# EAGLE schematic iForgeHat (EAGLE 8.1.0)

## Sheet 1 of 2
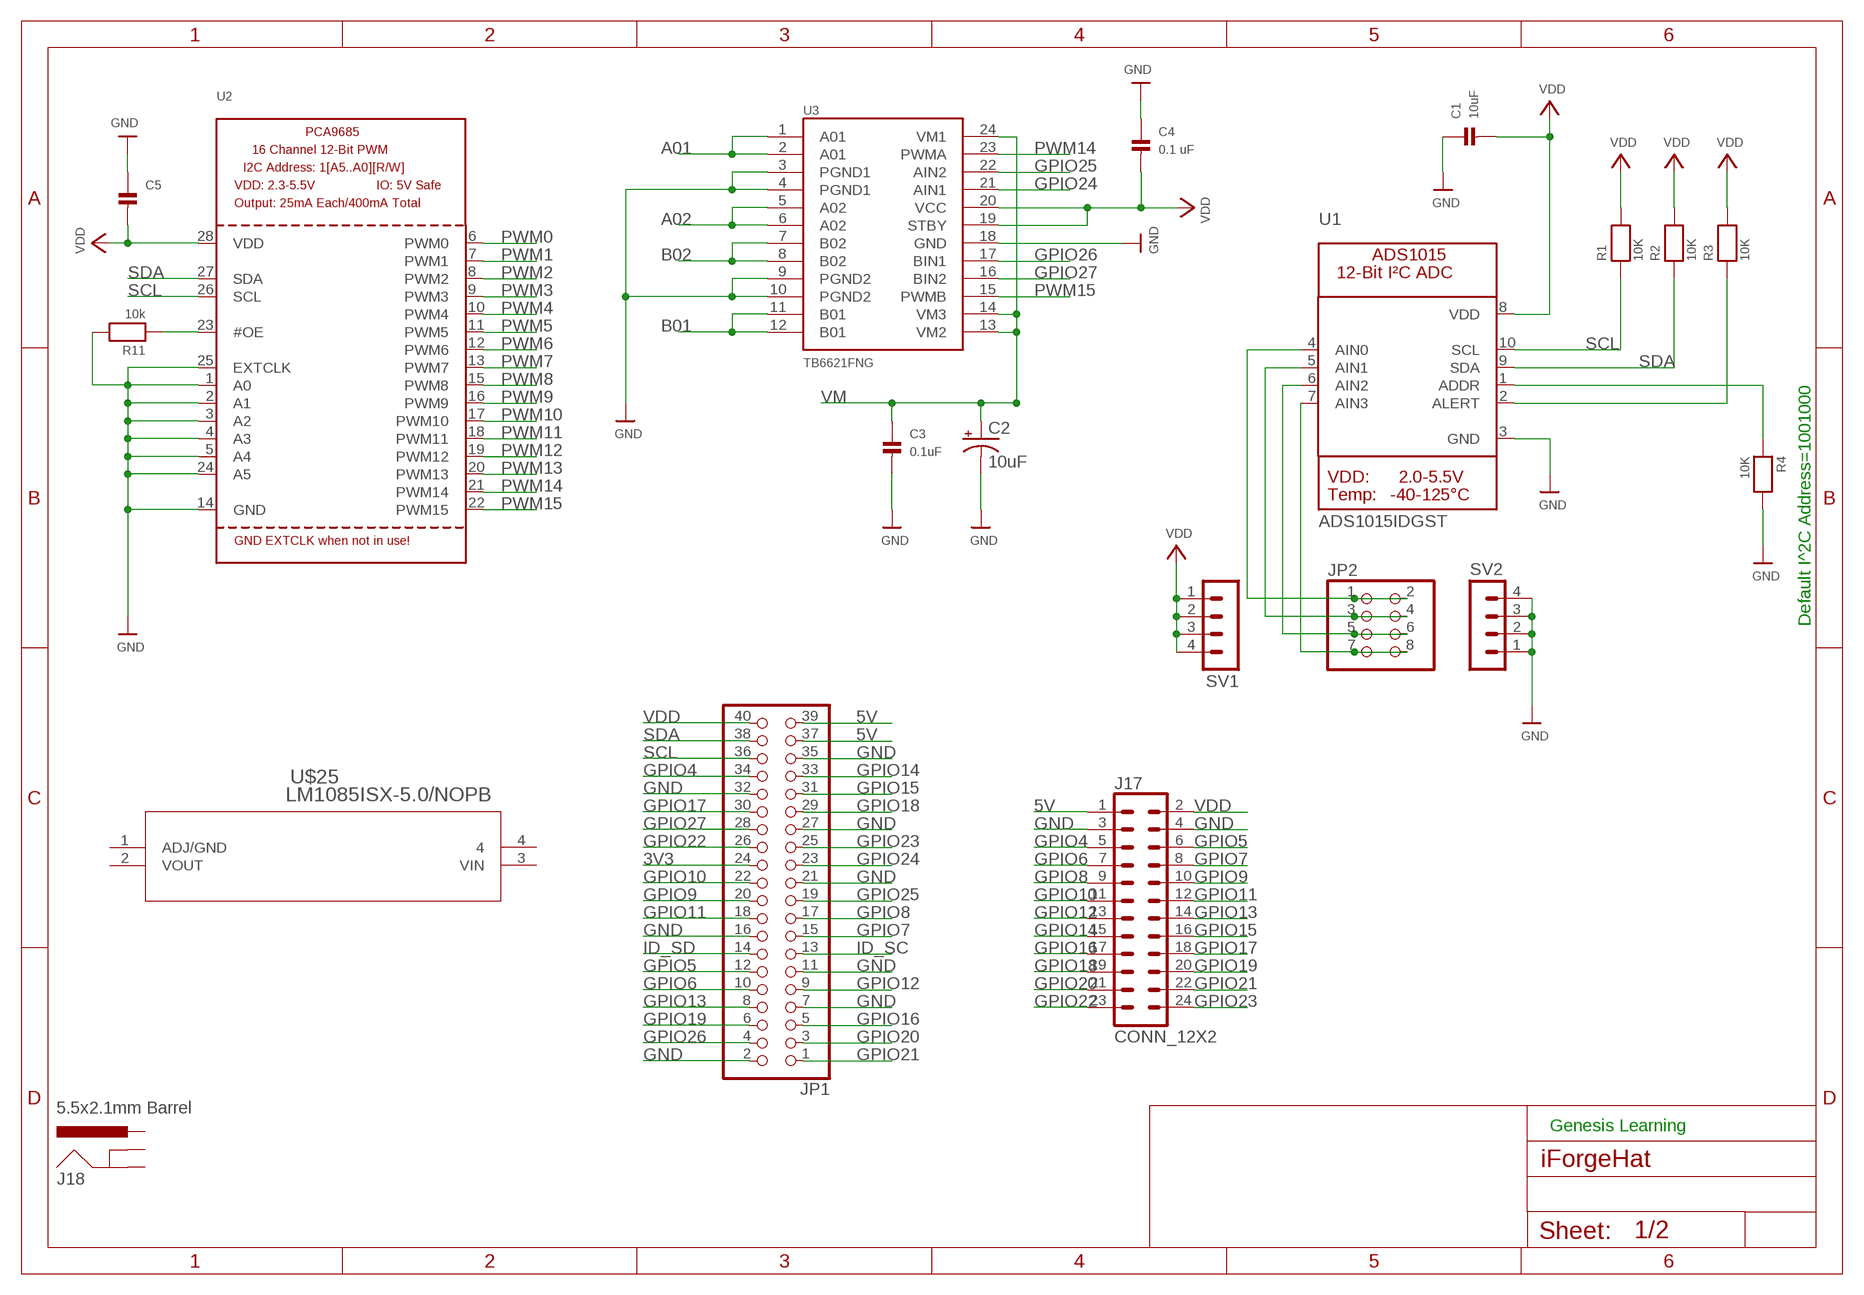
[diagram p0: schematic, sheet 1]

### Parts
C1  10uF  CAP_CERAMIC0402  [0402]
C2  10uF  SUPERCAP  [414-VA5R]
C3  0.1uF  CAP_CERAMIC0402  [0402]
C4  0.1 uF  CAP_CERAMIC0402  [0402]
C5  CAP_CERAMIC0402  [0402]
J17  CONN_12X2  [2X12]
J18  5.5x2.1mm Barrel  POWER_JACKSMD  [POWER_JACK_SMD]
JP1  PINHD-2X20  [2X20]
JP2  PINHD-2X4  [2X04]
R1  10K  RESISTOR0402  [0402]
R2  10K  RESISTOR0402  [0402]
R3  10K  RESISTOR0402  [0402]
R4  10K  RESISTOR0402  [0402]
R11  10k  RESISTOR0402  [0402]
SV1  MA04-1  [MA04-1]
SV2  MA04-1  [MA04-1]
U1  ADS1015IDGST  ADC_ADS1015  [MSOP10]
U2  PCA9685  [TSSOP28]
U3  TB6621FNG  [SSOP24]
U$25  LM1085ISX-5.0/NOPB  [TS3B]

### Nets
3V3: JP1.24
5V: J17.1 JP1.37 JP1.39
A01: U3.1(A01) U3.2(A01) ; also sheet 2
A02: U3.5(A02) U3.6(A02) ; also sheet 2
B01: U3.11(B01) U3.12(B01) ; also sheet 2
B02: U3.7(B02) U3.8(B02) ; also sheet 2
GND: C1.1 C2.- C3.2 C4.1 C5.1 J17.3 J17.4 JP1.2 JP1.7 JP1.11 JP1.16 JP1.21 JP1.27 JP1.32 JP1.35 R4.2 R11.2 SV2.1 SV2.2 SV2.3 SV2.4 U1.3(GND) U2.1(A0) U2.2(A1) U2.3(A2) U2.4(A3) U2.5(A4) U2.14(GND) U2.24(A5) U2.25(EXTCLK) U3.3(PGND1) U3.4(PGND1) U3.9(PGND2) U3.10(PGND2) U3.18(GND) ; also sheet 2
GPIO4: J17.5 JP1.34
GPIO5: J17.6 JP1.12
GPIO6: J17.7 JP1.10
GPIO7: J17.8 JP1.15
GPIO8: J17.9 JP1.17
GPIO9: J17.10 JP1.20
GPIO10: J17.11 JP1.22
GPIO11: J17.12 JP1.18
GPIO12: J17.13 JP1.9
GPIO13: J17.14 JP1.8
GPIO14: J17.15 JP1.33
GPIO15: J17.16 JP1.31
GPIO16: J17.17 JP1.5
GPIO17: J17.18 JP1.30
GPIO18: J17.19 JP1.29
GPIO19: J17.20 JP1.6
GPIO20: J17.21 JP1.3
GPIO21: J17.22 JP1.1
GPIO22: J17.23 JP1.26
GPIO23: J17.24 JP1.25
GPIO24: JP1.23 U3.21(AIN1)
GPIO25: JP1.19 U3.22(AIN2)
GPIO26: JP1.4 U3.17(BIN1)
GPIO27: JP1.28 U3.16(BIN2)
ID_SC: JP1.13
ID_SD: JP1.14
N$1: R11.1 U2.23(#OE)
N$3: R3.1 U1.2(ALERT)
N$4: R4.1 U1.1(ADDR)
N$7: JP2.1 JP2.2 U1.4(AIN0)
N$8: JP2.3 JP2.4 U1.5(AIN1)
N$9: JP2.5 JP2.6 U1.6(AIN2)
N$10: JP2.7 JP2.8 U1.7(AIN3)
PWM0: U2.6(PWM0) ; also sheet 2
PWM1: U2.7(PWM1) ; also sheet 2
PWM2: U2.8(PWM2) ; also sheet 2
PWM3: U2.9(PWM3) ; also sheet 2
PWM4: U2.10(PWM4) ; also sheet 2
PWM5: U2.11(PWM5) ; also sheet 2
PWM6: U2.12(PWM6) ; also sheet 2
PWM7: U2.13(PWM7) ; also sheet 2
PWM8: U2.15(PWM8) ; also sheet 2
PWM9: U2.16(PWM9) ; also sheet 2
PWM10: U2.17(PWM10) ; also sheet 2
PWM11: U2.18(PWM11) ; also sheet 2
PWM12: U2.19(PWM12) ; also sheet 2
PWM13: U2.20(PWM13) ; also sheet 2
PWM14: U2.21(PWM14) U3.23(PWMA)
PWM15: U2.22(PWM15) U3.15(PWMB)
SCL: JP1.36 R1.1 U1.10(SCL) U2.26(SCL)
SDA: JP1.38 R2.1 U1.9(SDA) U2.27(SDA)
VDD: C1.2 C4.2 C5.2 J17.2 JP1.40 R1.2 R2.2 R3.2 SV1.1 SV1.2 SV1.3 SV1.4 U1.8(VDD) U2.28(VDD) U3.19(STBY) U3.20(VCC) ; also sheet 2
VM: C2.+ C3.1 U3.13(VM2) U3.14(VM3) U3.24(VM1)
Unconnected: J18.GND(GNDBREAK) J18.P$4(GND) J18.VIN0(PWR) U$25.1(ADJ/GND) U$25.2(VOUT) U$25.3(VIN) U$25.4

### Notes on the sheet
- Default I^2C Address=1001000
- Genesis Learning

## Sheet 2 of 2
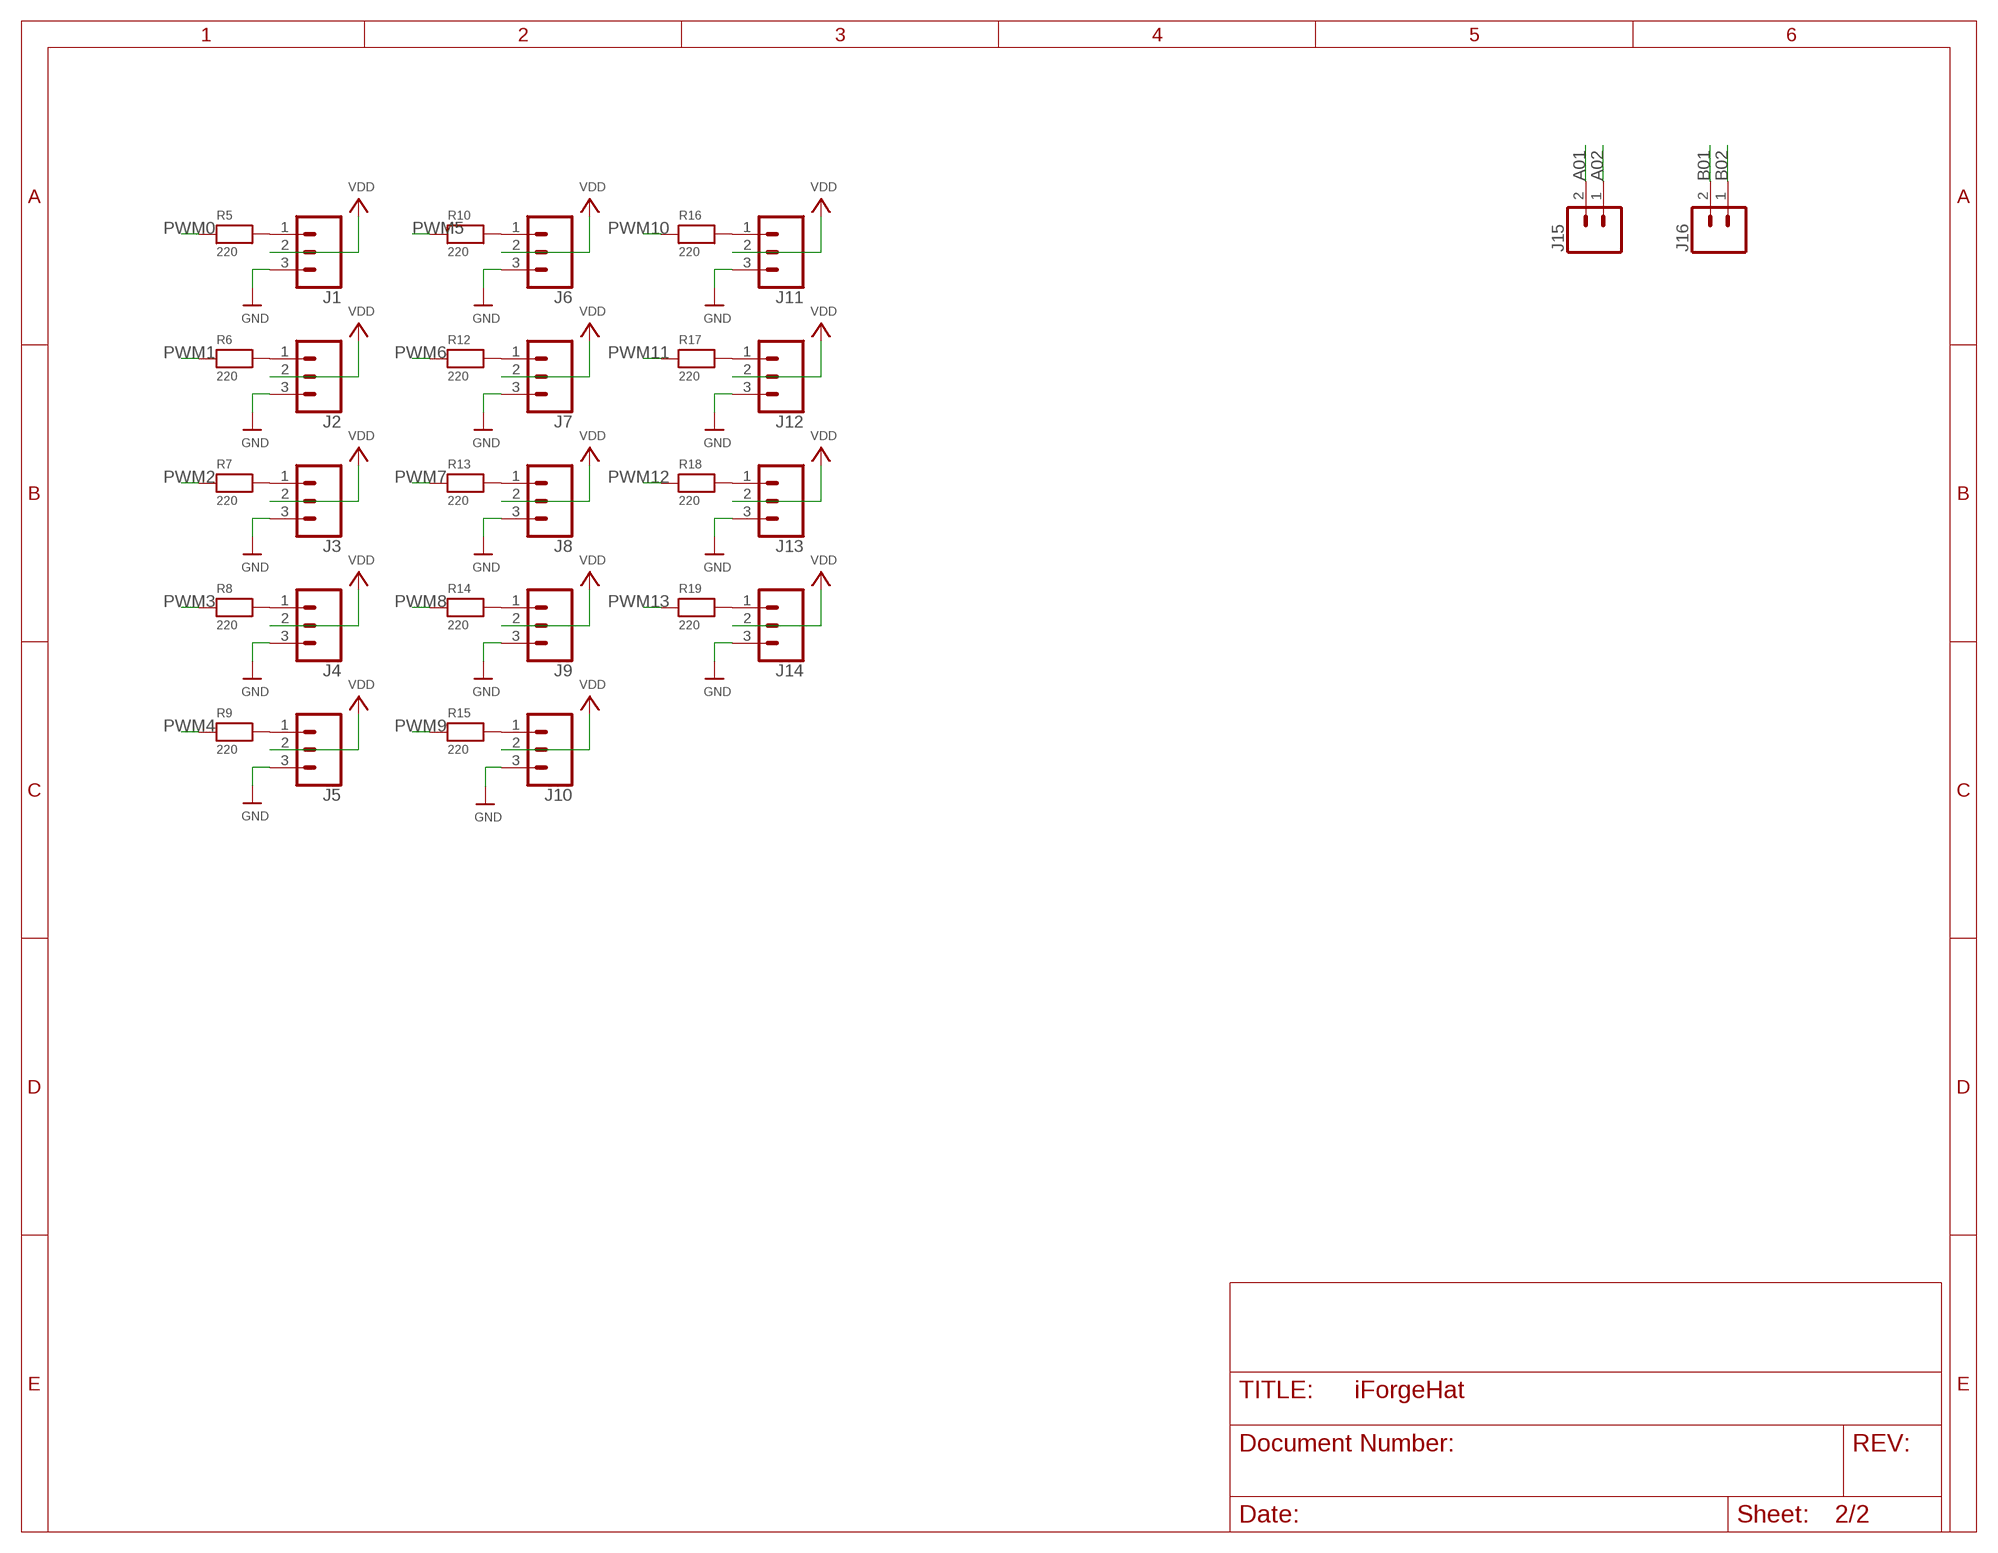
[diagram p1: schematic, sheet 2]

### Parts
J1  CONN_03  [1X03]
J2  CONN_03  [1X03]
J3  CONN_03  [1X03]
J4  CONN_03  [1X03]
J5  CONN_03  [1X03]
J6  CONN_03  [1X03]
J7  CONN_03  [1X03]
J8  CONN_03  [1X03]
J9  CONN_03  [1X03]
J10  CONN_03  [1X03]
J11  CONN_03  [1X03]
J12  CONN_03  [1X03]
J13  CONN_03  [1X03]
J14  CONN_03  [1X03]
J15  CONN_02SPRING-2.54-RA  [SPRINGTERMINAL-2.54MM-2]
J16  CONN_02SPRING-2.54-RA  [SPRINGTERMINAL-2.54MM-2]
R5  220  RESISTOR0402  [0402]
R6  220  RESISTOR0402  [0402]
R7  220  RESISTOR0402  [0402]
R8  220  RESISTOR0402  [0402]
R9  220  RESISTOR0402  [0402]
R10  220  RESISTOR0402  [0402]
R12  220  RESISTOR0402  [0402]
R13  220  RESISTOR0402  [0402]
R14  220  RESISTOR0402  [0402]
R15  220  RESISTOR0402  [0402]
R16  220  RESISTOR0402  [0402]
R17  220  RESISTOR0402  [0402]
R18  220  RESISTOR0402  [0402]
R19  220  RESISTOR0402  [0402]

### Nets
A01: J15.2 ; also sheet 1
A02: J15.1 ; also sheet 1
B01: J16.2 ; also sheet 1
B02: J16.1 ; also sheet 1
GND: J1.3 J2.3 J3.3 J4.3 J5.3 J6.3 J7.3 J8.3 J9.3 J10.3 J11.3 J12.3 J13.3 J14.3 ; also sheet 1
N$2: J14.1 R19.2
N$5: J11.1 R16.2
N$6: J12.1 R17.2
N$11: J6.1 R10.2
N$12: J7.1 R12.2
N$13: J9.1 R14.2
N$14: J5.1 R9.2
N$15: J4.1 R8.2
N$16: J3.1 R7.2
N$17: J2.1 R6.2
N$18: J1.1 R5.2
N$19: J13.1 R18.2
N$20: J8.1 R13.2
N$21: J10.1 R15.2
PWM0: R5.1 ; also sheet 1
PWM1: R6.1 ; also sheet 1
PWM2: R7.1 ; also sheet 1
PWM3: R8.1 ; also sheet 1
PWM4: R9.1 ; also sheet 1
PWM5: R10.1 ; also sheet 1
PWM6: R12.1 ; also sheet 1
PWM7: R13.1 ; also sheet 1
PWM8: R14.1 ; also sheet 1
PWM9: R15.1 ; also sheet 1
PWM10: R16.1 ; also sheet 1
PWM11: R17.1 ; also sheet 1
PWM12: R18.1 ; also sheet 1
PWM13: R19.1 ; also sheet 1
VDD: J1.2 J2.2 J3.2 J4.2 J5.2 J6.2 J7.2 J8.2 J9.2 J10.2 J11.2 J12.2 J13.2 J14.2 ; also sheet 1

## Library data of the parts
C1 C3-C5 = adc1015microbuilder:CAP_CERAMIC: Ceramic Capacitors 0402 - 0402 Surface Mount Capacitors 16pF 50V 5% [Digikey: 445-4899-2-ND] 18pF 50V 5% [Digikey: 490-1281-2-ND] 22pF 50V 5% [Digikey: 490-1283-2-ND] 68pF 50V 5% [Digikey: 490-1289-2-ND] 0.1uF 10V 10% [Digikey: 490-1318-2-ND] 1.0uF 6.3V 10% [Digikey: 490-1320-2-ND] 0603 - 0603 Surface Mount Capacitors 16 pF 50V 5% [Digikey: 445-5051-2-ND] 22 pF 50V [Digikey: PCC220ACVTR-ND] 33 pF 50V 5% [Digikey: 490-1415-1-ND] 56pF 50V 5% [Digikey: 490-1421-1-ND] 220pF 50V 5% [Digikey: 445-1285-1-ND] 680 pF 50V 2200 pF 50V 5% C0G [Digikey: 445-1297-1-ND] 5600 pF 100V 5% X7R [Digikey: 478-3711-1-ND] 0.1 µF 25V 10% [Digikey: PCC2277TR-ND] 0.22 µF 16V 10% X7R [Digikey: 445-1318-1-ND] 1.0 µF 25V 10% [Digikey: 445-5146-2-ND] 0603 - RF Specific 3pF 250V +/-0.1pF RF [Digikey: 712-1347-1-ND] 18 pF 250V 5% [Digikey: 478-3505-1-ND or 712-1322-1-ND] 56 pF 250V 5% C0G RF [Digikey: 490-4867-1-ND] 68 pF 250V RF [Digikey: 490-4868-1-ND] 0805 - 0805 Surface Mount Capacitors 220 pF 250V 2% RF Ceramic Capacitor [Digikey: 712-1398-1-ND] 1000 pF 50V 2% NP0 Ceramic Capacitor [Digikey: 478-3760-1-ND] 0.1 µF 25V 10% Ceramic Capacitor [Digikey: PCC1828TR-ND] 1.0 µF 16V 10% Ceramic Capacitor[Digikey: 490-1691-2-ND] 10.0 µF 10V 10% Ceramic Capacitor[Digikey: 709-1228-1-ND] 10.0 uF 16V 10% Ceramic Capacitor [Digikey: 478-5165-2-ND] 47 uF 6.3V 20% Ceramic Capacitor [Digikey: 587-1779-1-ND or 399-5506-1-ND] 1206 - 1206 Surface Mount Capacitors 47uF 10V 20% Ceramic Capacitor [Digikey: 490-5528-1-ND or 399-5508-1-ND or 445-6010-1-ND] 100uF 6.3V -20%, +80% Y5V Ceramic Capacitor (Digikey: 490-4512-1-ND, Mouser: 81-GRM31CF50J107ZE1L)
C2 = adafruit:SUPERCAP
J1-J14 = SparkFun-Connectors:CONN_03: Multi connection point. Often used as Generic Header-pin footprint for 0.1 inch spaced/style header connections On any of the 0.1 inch spaced packages, you can populate with these: Break Away Headers - Straight <https://www.sparkfun.com/products/116> (PRT-00116) Break Away Male Headers - Right Angle <https://www.sparkfun.com/products/553> (PRT-00553) Female Headers <https://www.sparkfun.com/products/115> (PRT-00115) Break Away Headers - Machine Pin <https://www.sparkfun.com/products/117> (PRT-00117) Break Away Female Headers - Swiss Machine Pin <https://www.sparkfun.com/products/743> (PRT-00743) Stackable Header - 3 Pin (Female, 0.1") <https://www.sparkfun.com/products/13875> (PRT-13875) For SCREWTERMINALS and SPRING TERMINALS visit here: Screw Terimnals on SparkFun.com <https://www.sparkfun.com/search/results?term=Screw+Terminals> (5mm/3.5mm/2.54mm spacing) This device is also useful as a general connection point to wire up your design to another part of your project. Our various solder wires solder well into these plated through hole pads. Hook-Up Wire - Assortment (Stranded, 22 AWG) <https://www.sparkfun.com/products/11375> (PRT-11375) Hook-Up Wire - Assortment (Solid Core, 22 AWG) <https://www.sparkfun.com/products/11367> (PRT-11367) View the entire wire category on our website here <https://www.sparkfun.com/categories/141> Special notes: Molex polarized connector foot print use with SKU : PRT-08232 with associated crimp pins and housings.
J15 J16 = SparkFun-Connectors:CONN_02: Multi connection point. Often used as Generic Header-pin footprint for 0.1 inch spaced/style header connections On any of the 0.1 inch spaced packages, you can populate with these: Break Away Headers - Straight <https://www.sparkfun.com/products/116> (PRT-00116) Break Away Male Headers - Right Angle <https://www.sparkfun.com/products/553> (PRT-00553) Female Headers <https://www.sparkfun.com/products/115> (PRT-00115) Break Away Headers - Machine Pin <https://www.sparkfun.com/products/117> (PRT-00117) Break Away Female Headers - Swiss Machine Pin <https://www.sparkfun.com/products/743> (PRT-00743) For SCREWTERMINALS and SPRING TERMINALS visit here: Screw Terimnals on SparkFun.com <https://www.sparkfun.com/search/results?term=Screw+Terminals> (5mm/3.5mm/2.54mm spacing) This device is also useful as a general connection point to wire up your design to another part of your project. Our various solder wires solder well into these plated through hole pads. Hook-Up Wire - Assortment (Stranded, 22 AWG) <https://www.sparkfun.com/products/11375> (PRT-11375) Hook-Up Wire - Assortment (Solid Core, 22 AWG) <https://www.sparkfun.com/products/11367> (PRT-11367) View the entire wire category on our website here <https://www.sparkfun.com/categories/141> Special notes: Molex polarized connector foot print use with: PRT-08233 with associated crimp pins and housings. 2.54_SCREWTERM for use with PRT-10571. 3.5mm Screw Terminal footprints for PRT-08084 5mm Screw Terminal footprints for use with PRT-08432
J17 = SparkFun-Connectors:CONN_12X2: Multi connection point. Often used as Generic Header-pin footprint for 0.1 inch spaced/style header connections On any of the 0.1 inch spaced packages, you can populate with these: Break Away Headers - Straight <https://www.sparkfun.com/products/116> (PRT-00116) Break Away Male Headers - Right Angle <https://www.sparkfun.com/products/553> (PRT-00553) Female Headers <https://www.sparkfun.com/products/115> (PRT-00115) Break Away Headers - Machine Pin <https://www.sparkfun.com/products/117> (PRT-00117) Break Away Female Headers - Swiss Machine Pin <https://www.sparkfun.com/products/743> (PRT-00743)
J18 = SparkFun-Connectors:POWER_JACK: Power Jack Connector This is the standard 5.5mm barrel jack for power. The PTH is the most common, proven, reliable, footprint. The Slot footprint only works if the mill layer is transmitted to the PCB fab house so be warned. Here are the connectors we sell at SparkFun: DC Barrel Power Jack/Connector <https://www.sparkfun.com/products/119> (PRT-00119) DC Barrel Power Jack/Connector (SMD) <https://www.sparkfun.com/products/12748> (PRT-12748) DC Barrel Jack Adapter - Breadboard Compatible <https://www.sparkfun.com/products/10811> (PRT-10811) It is used on this SparkFun product (and many, many others): SparkFun RedBoard - Programmed with Arduino <https://www.sparkfun.com/products/12757> (DEV-12757) Also, if you need a mating power supply or connector, please check these out: Wall Adapter Power Supply - 9VDC 650mA <https://www.sparkfun.com/products/298> (TOL-00298) DC Barrel Jack Adapter - Male <https://www.sparkfun.com/products/10287> (PRT-10287); PROD_ID: CONN-08106; SF_ID: PRT-12748
JP1 = adafruit:PINHD-2X20: PIN HEADER
JP2 = adafruit:PINHD-2X4: PIN HEADER
R1-R19 = adc1015microbuilder:RESISTOR: Resistors 0402 - 0402 Surface Mount Package 22 Ohm 1% 1/16W [Digikey: 311-22.0LRTR-ND] 33 Ohm 5% 1/16W 1.0K 5% 1/16W 1.5K 5% 1/16W 2.0K 1% 1/16W 10.0K 1% 1/16W [Digikey: 311-10.0KLRTR-ND] 10.0K 5% 1/16W [Digikey: RMCF0402JT10K0TR-ND] 12.1K 1% 1/16W [Digikey: 311-22.0LRTR-ND] 100.0K 5% 1/16W 0603 - 0603 Surface Mount Package 0 Ohm 1/10 Watt 1% Resistor 15 Ohm 1/10 Watt 1% Resistor 33 Ohm 1/10 Watt 1% Resistor 49.9 Ohm 1/10 Watt 1% Resistor 100 Ohm 1/10 Watt 1% Resistor 150 Ohm 1/10 Watt 1% Resistor 240 Ohm 1/10 Watt 1% Resistor 390 Ohm 1/10 Watt 1% Resistor 560 Ohm 1/10 Watt 1% Resistor 680 Ohm 1/10 Watt 1% Resistor 750 Ohm 1/10 Watt 1% Resistor 1.0K Ohm 1/10 Watt 1% Resistor 1.5K Ohm 1/10 Watt 1% Resistor 2.0K Ohm 1/10 Watt 1% Resistor 2.2K Ohm 1/10 Watt 1% Resistor 3.3K Ohm 1/10 Watt 1% Resistor 4.7K Ohm 1/10 Watt 1% Resistor 10.0K Ohm 1/10 Watt 1% Resistor 12.0K Ohm 1/10 Watt 1% Resistor 12.1K Ohm 1/10 Watt 1% Resistor 20.0K Ohm 1/10 Watt 1% Resistor 33.0K Ohm 1/10 Watt 1% Resistor 100.0K Ohm 1/10 Watt 1% Resistor 0805 - 0805 Surface Mount Package 0 Ohm 1/8 Watt 1% Resistor 33 Ohm 1/8 Watt 1% Resistor 100 Ohm 1/8 Watt 1% Resistor 150 Ohm 1/8 Watt 1% Resistor 200 Ohm 1/8 Watt 1% Resistor 240 Ohm 1/8 Watt 1% Resistor 330 Ohm 1/8 Watt 1% Resistor 390 Ohm 1/8 Watt 1% Resistor 470 Ohm 1/8 Watt 1% Resistor 1.0K Ohm 1/8 Watt 1% Resistor 1.5K Ohm 1/8 Watt 1% Resistor 2.0K Ohm 1/8 Watt 1% Resistor 4.7K Ohm 1/8 Watt 1% Resistor 5.1K Ohm 1/8 Watt 1% Resistor 5.6K Ohm 1/8 Watt 1% Resistor 10.0K Ohm 1/8 Watt 1% Resistor 22.0K Ohm 1/8 Watt 1% Resistor 33.0K Ohm 1/8 Watt 1% Resistor 100K Ohm 1/8 Watt 1% Resistor 1206 - 1206 Surface Mount Package 2012 - 2010 Surface Mount Package 0.11 Ohm 1/2 Watt 1% Resistor - Digikey: RHM.11UCT-ND
SV1 SV2 = con-lstb:MA04-1: PIN HEADER; OC_FARNELL: unknown; OC_NEWARK: unknown
U1 = microbuilder:ADC_ADS1015: ADS1015 - 12-bit 4-Channel I2C ADC with Internal PGA VDD: 2.0-5.5V Sampling Rate: 3.3ksps Gain Settings: 2/3, 1, 2, 4, 8, 16 I2C Address: ADDR low = 1001000x, ADDR high = 1001001x Internal Comparator The ADS1015 includes an internal comparator that can be set to output a high-level on ALERT when the conversion results exceeeds a pre-defined upper level, and will deassert itself when the level falls below a pre-defined lower threshold level. It can also be set to windowed mode where the ALERT pin will be asserted if the data exceeds the upper threshold or falls below the lower threshold.
U2 = adafruit:PCA9685: PCA9685 - 16 Channel 12-Bit I2C PWM Controller 5.0V tolerant 16 channel, 12-bit I2C PWM controller with 25mA per output (max. 400mA total) Digikey: 568-5931-1-ND
U3 = SparkFun:TB6621FNG: Toshiba 1A motor driver
U$25 = TIVoltage:LM1085ISX-5.0/NOPB; MANUFACTURER_PART_NUMBER: LM1085ISX5.0NOPB; VENDOR: National Semiconductor